# Altium project POE12V3A.PrjPcb
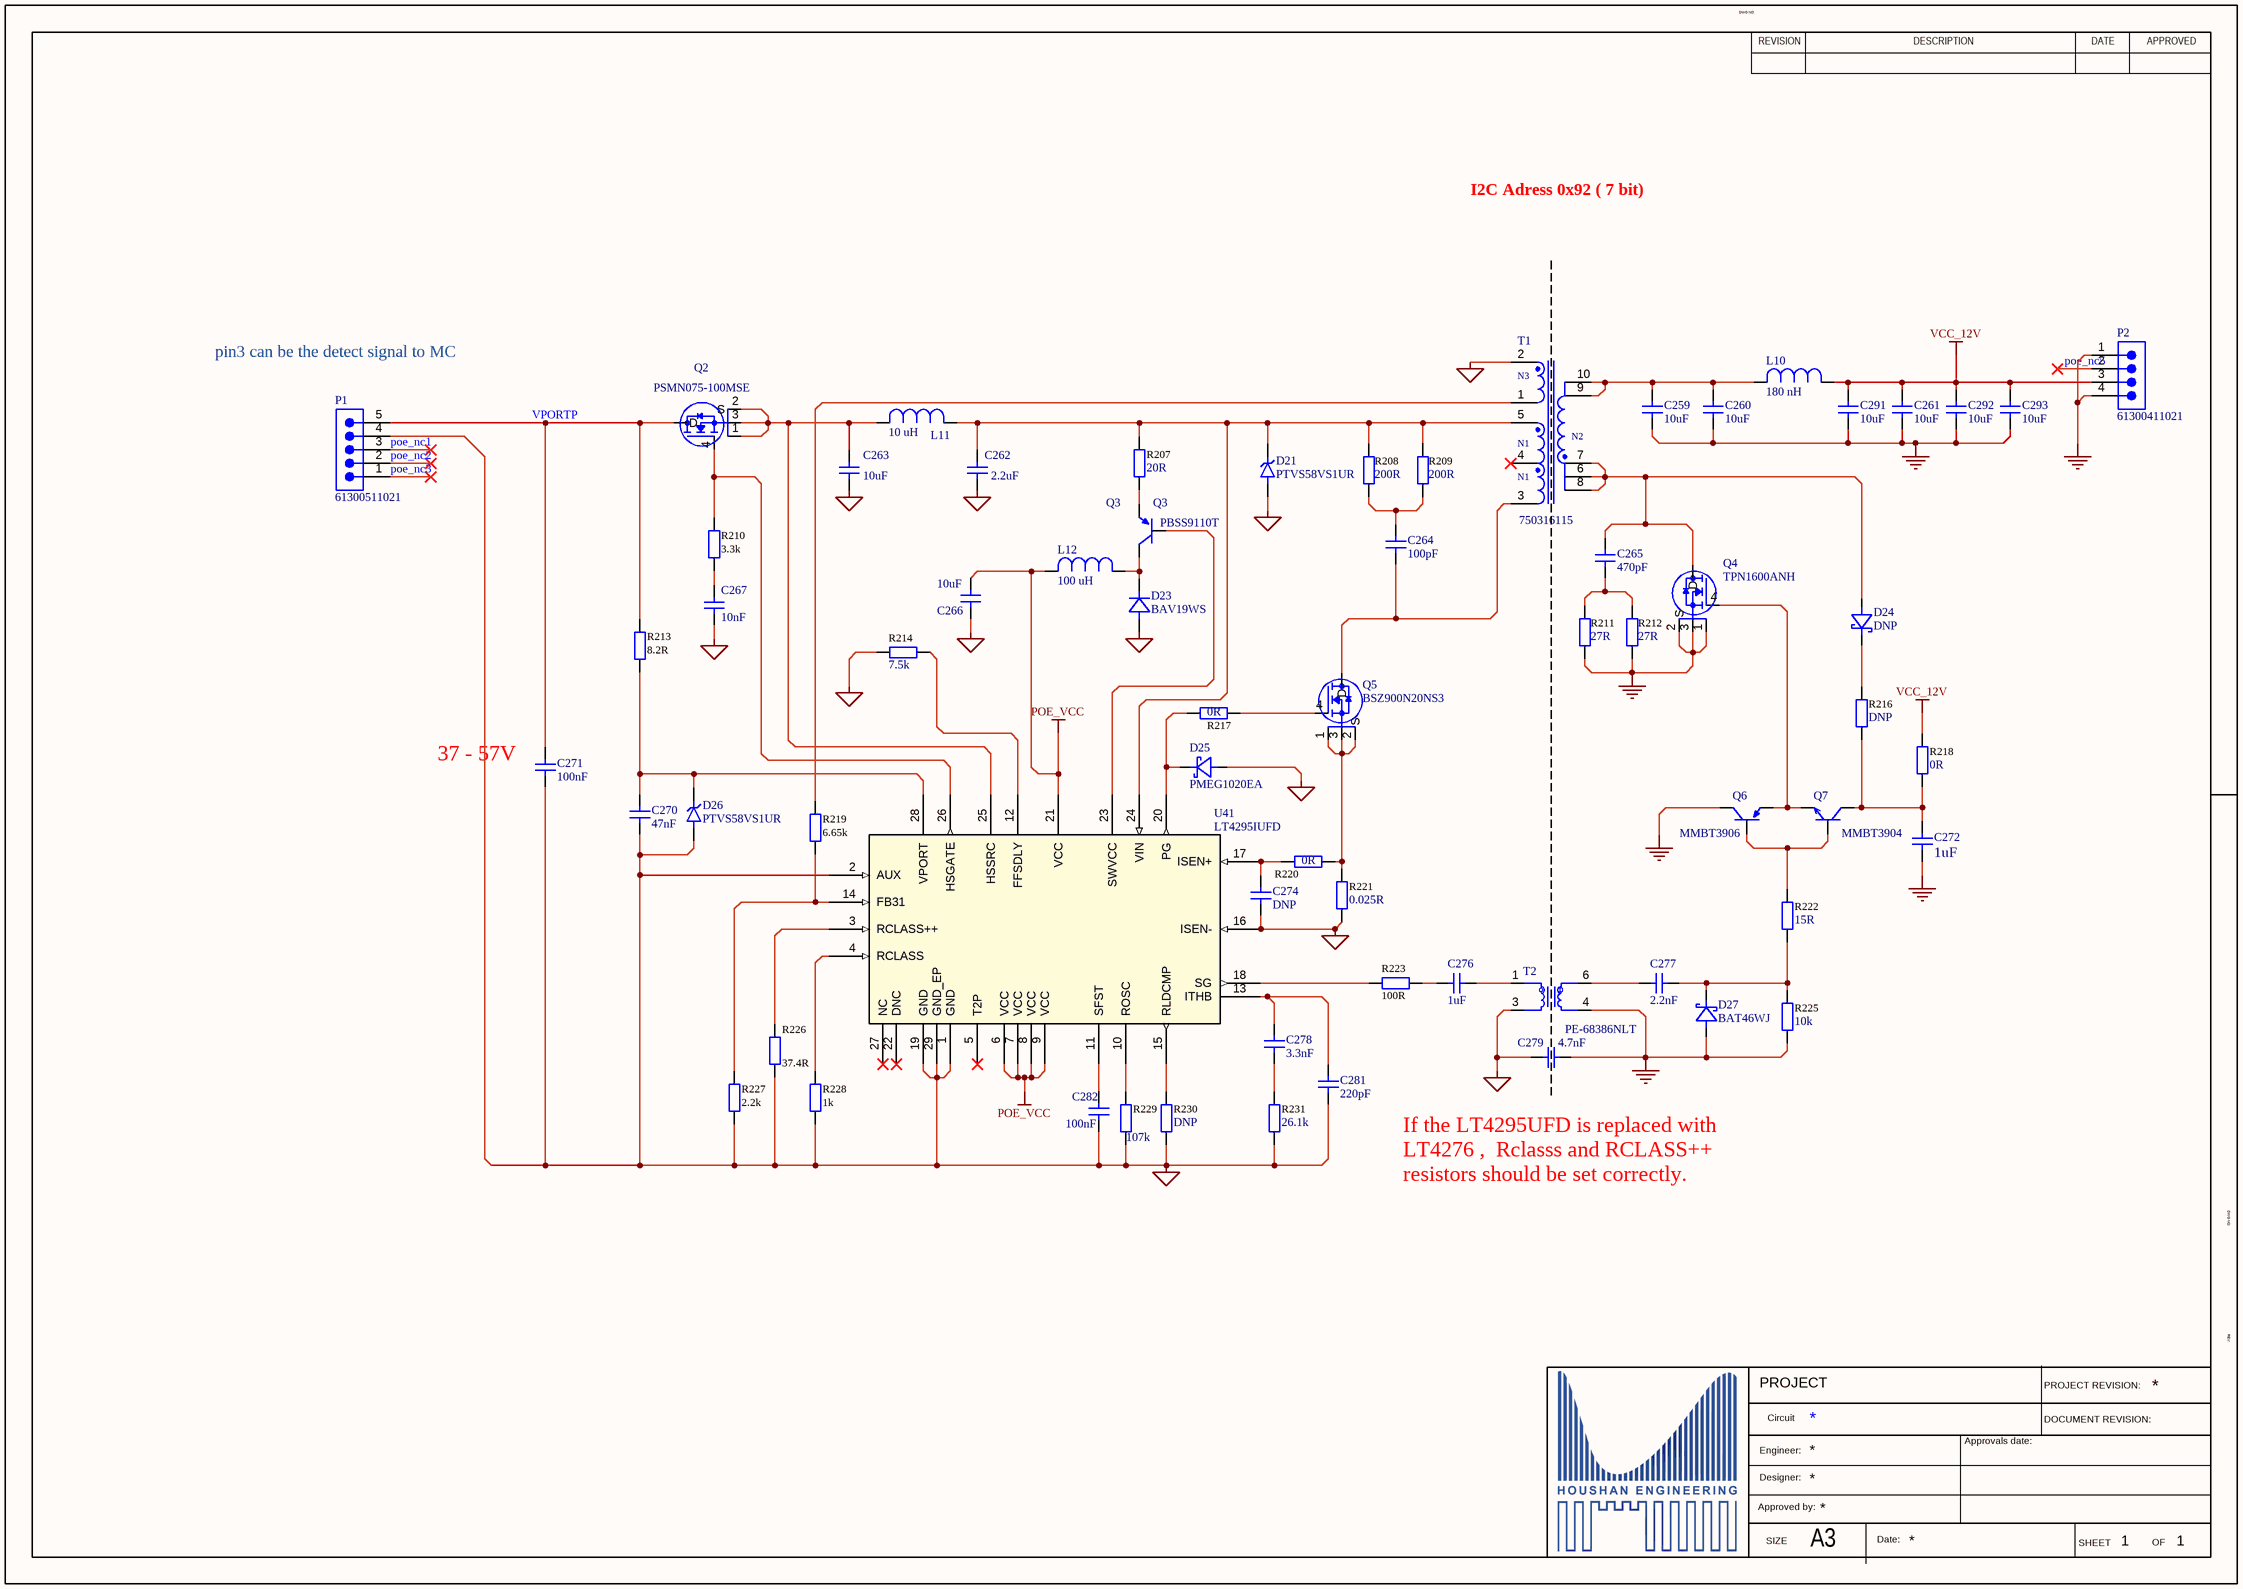
[diagram p0: POE.SchDoc]
1 sheet, 65 parts. Net scope: global (net labels, ports and power ports of the same name join across sheets).
Board file: POE.PcbDoc

## Sheet POE.SchDoc
size 420 x 297 mm; SheetNumber: 1; SheetTotal: 1

### Parts
C259  10uF  [C0805]
C260  10uF  [C0805]
C261  10uF  [C0805]
C262  2.2uF  [C1206]
C263  10uF  [C1210]
C264  100pF  [C1206]
C265  470pF  [C1206]
C266  10uF  [C1206]
C267  10nF  [C0603]
C270  47nF  [C0603]
C271  100nF  [C0603]
C272  1uF  [C0805]
C274  DNP  [C0402]
C276  1uF  [C0603]
C277  2.2nF  [C0603]
C278  3.3nF  [C0603]
C279  4.7nF  [C1812]
C281  220pF  [C0603]
C282  100nF  [C0603]
C291  10uF  [C0805]
C292  10uF  [C0805]
C293  10uF  [C0805]
D21  PTVS58VS1UR  [SOD123W]
D23  BAV19WS  [SOD323]
D24  DNP  [SOD323]
D25  PMEG1020EA  [SOD323]
D26  PTVS58VS1UR  [SOD123W]
D27  BAT46WJ  [SOD323F]
L10  180 nH  [IND_DO1813H_COC]
L11  10 uH  [IND_DO1607B_COC]
L12  100 uH  [IND_DO1607B_COC]
P1  61300511021  [61300511021]
P2  61300411021  [61300411021]
Q2  PSMN075-100MSE  [SOT1210]
Q3  PBSS9110T  [SOT23]
Q4  TPN1600ANH  [SOT1210]
Q5  BSZ900N20NS3  [SOT1210]
Q6  MMBT3906  [SOT23]
Q7  MMBT3904  [SOT23]
R207  20R  [R0805]
R208  200R  [R1206]
R209  200R  [R1206]
R210  3.3k  [R0603]
R211  27R  [R1206]
R212  27R  [R1206]
R213  8.2R  [R0805]
R214  7.5k  [R0603]
R216  DNP  [R0805]
R217  0R  [R0603]
R218  0R  [R0805]
R219  6.65k  [R0603]
R220  0R  [R0603]
R221  0.025R  [R1206]
R222  15R  [R0603]
R223  100R  [R0603]
R225  10k  [R0603]
R226  37.4R  [R0805]
R227  2.2k  [R0603]
R228  1k  [R0805]
R229  107k  [R0603]
R230  DNP  [R0603]
R231  26.1k  [R0603]
T1  750316115  [WE-PoE+_EP13_L17.75W13.46H12.7]
T2  PE-68386NLT  [SOP254P864X249-6N]
U41  LT4295IUFD  [QFN-29_UFD]

### Nets
GND: C259.1 C260.1 C261.1 C272.2 C279.1 C291.1 C292.1 C293.1 D27.2(A) P2.1 P2.4 Q4.1(S) Q4.2(S) Q4.3(S) Q6.3(C) R211.1 R212.1 R225.1 T2.4
POE_GND: C262.1 C263.1 C266.1 C267.1 C270.1 C271.1 C274.1 C279.2 C281.2 C282.1 D21.2(A) D23.2(A) D25.2(A) D26.2(A) P1.4 R214.2 R221.1 R226.1 R227.1 R228.1 R229.1 R230.1 R231.1 T1.2 T2.3 U41.1(GND) U41.2(AUX) U41.16(ISEN-) U41.19(GND) U41.29(GND_EP)
POE_VCC: C266.2 L12.2 U41.6(VCC) U41.7(VCC) U41.8(VCC) U41.9(VCC) U41.21(VCC)
VCC_12V: C261.2 C291.2 C292.2 C293.2 L10.1 P2.3 R218.2
poe_nc1: P1.3
poe_nc2: P1.2
poe_nc3: P1.1
poe_nc5: P2.2
VPORTP: C271.2 P1.5 Q2.MB(D) R213.2
NetC259_2: C259.2 C260.2 L10.2 T1.9 T1.10
NetC262_2: C262.2 D21.1(K) L11.1 R207.2 R208.2 R209.2 T1.5 U41.24(VIN)
NetC263_2: C263.2 L11.2 Q2.1(S) Q2.2(S) Q2.3(S) U41.25(HSSRC)
NetC264_1: C264.1 Q5.MB(D) T1.3
NetC264_2: C264.2 R208.1 R209.1
NetC265_1: C265.1 R211.2 R212.2
NetC265_2: C265.2 D24.2(A) Q4.MB(D) T1.6 T1.7 T1.8
NetC267_2: C267.2 R210.1
NetC270_2: C270.2 D26.1(K) R213.1 U41.28(VPORT)
NetC272_1: C272.1 Q7.3(C) R216.1 R218.1
NetC274_2: C274.2 R220.2 U41.17(ISEN+)
NetC276_1: C276.1 T2.1
NetC276_2: C276.2 R223.2
NetC277_1: C277.1 D27.1(K) R222.1 R225.2
NetC277_2: C277.2 T2.6
NetC278_1: C278.1 R231.2
NetC278_2: C278.2 C281.1 U41.13(ITHB)
NetC282_2: C282.2 U41.11(SFST)
NetD23_1: D23.1(K) L12.1 Q3.3(C)
NetD24_1: D24.1(K) R216.2
NetD25_1: D25.1(K) R217.2 U41.20(PG)
NetQ2_4: Q2.4(G) R210.2 U41.26(HSGATE)
NetQ3_1: Q3.1(B) U41.23(SWVCC)
NetQ3_2: Q3.2(E) R207.1
NetQ4_4: Q4.4(G) Q6.2(E) Q7.2(E)
NetQ5_1: Q5.1(S) Q5.2(S) Q5.3(S) R220.1 R221.2
NetQ5_4: Q5.4(G) R217.1
NetQ6_1: Q6.1(B) Q7.1(B) R222.2
NetR214_1: R214.1 U41.12(FFSDLY)
NetR219_1: R219.1 R227.2 U41.14(FB31)
NetR219_2: R219.2 T1.1
NetR223_1: R223.1 U41.18(SG)
NetR226_2: R226.2 U41.3(RCLASS++)
NetR228_2: R228.2 U41.4(RCLASS)
NetR229_2: R229.2 U41.10(ROSC)
NetR230_2: R230.2 U41.15(RLDCMP)

Not connected (* = marked no-connect by the designer): T1 4*; U41 5(T2P)* 22(DNC)* 27(NC)*

### Notes on the sheet
- I2C Adress 0x92 ( 7 bit)
- pin3 can be the detect signal to MC
- Q3
- (near C271) 37 - 57V
- If the LT4295UFD is replaced with LT4276 ,  Rclasss and RCLASS++ resistors should be set correctly.
- DWG NO:
- REVISION
- DESCRIPTION
- DATE
- APPROVED
- REV:
- PROJECT
- PROJECT REVISION:
- Engineer:
- Circuit
- Approvals date:
- DOCUMENT REVISION:
- Approved by:
- Designer:
- SIZE
- Date:
- SHEET
- OF
- A3
- (in symbol 750316115) N3; N2; N1

### Library data of the parts
C259-C261 C291-C293 = C0805_10uF_50V_10%_X5R: Multilayer Ceramic Capacitors MLCC - SMD/SMT 10uF 50V X5R C0805 10 %; Tolerance: 10%; Assembly: SMT; Part Number: C0805_10uF_50V_10%_X5R; Pin Count: 2; Value: 10uF; Manufacturer Part Number: C0805_10uF_50V_10%_X5R; Category: MLCC; Component Height: 0.45mm; Temperature Coefficient: X5R; Voltage Rating: 50V
C262 = C1206_2.2uF_100V_10%_X7R: Multilayer Ceramic Capacitors MLCC - SMD/SMT 2.2uF 100V X7R 1206 10%; Assembly: SMT; Part Number: C1206_2.2uF_100V_10%_X7R; Category: MLCC; Pin Count: 2; Component Height: 1.6mm; Value: 2.2uF; Manufacturer Part Number: C1206_2.2uF_100V_10%_X7R; Temperature Coefficient: X7R; Tolerance: 10%; Voltage Rating: 100V
C263 = C1210_10uF_100V_10%_X7S: Multilayer Ceramic Capacitors MLCC - SMD/SMT 10uF 100V X7S 1210 10%; Assembly: SMT; Part Number: C1210_10uF_100V_10%_X7S; Category: MLCC; Pin Count: 2; Component Height: 2mm; Value: 10uF; Manufacturer Part Number: C1210_10uF_100V_10%_X7S; Temperature Coefficient: X7S; Tolerance: 10%; Voltage Rating: 100V
C264 = C1206_100pF_630V_5%_U2J: Multilayer Ceramic Capacitors MLCC - SMD/SMT 100pF 630V U2J 1206 5%; Assembly: SMT; Part Number: C1206_100pF_630V_5%_U2J; Pin Count: 2; Value: 100pF; Tolerance: 5%; Manufacturer Part Number: C1206_100pF_630V_5%_U2J; Category: MLCC; Component Height: 0.55mm; Temperature Coefficient: U2J; Voltage Rating: 630V
C265 = C1206_470pF_630V_5%_U2J: Multilayer Ceramic Capacitors MLCC - SMD/SMT 470pF 630V U2J 1206 5%; Assembly: SMT; Part Number: C1206_470pF_630V_5%_U2J; Pin Count: 2; Value: 470pF; Tolerance: 5%; Manufacturer Part Number: C1206_470pF_630V_5%_U2J; Category: MLCC; Component Height: 0.55mm; Temperature Coefficient: U2J; Voltage Rating: 630V
C266 = C1206_10uF_25V_10%_X7R: Multilayer Ceramic Capacitors MLCC - SMD/SMT 10uF 25V X7R 1206  10%; Assembly: SMT; Part Number: C1206_10uF_25V_10%_X7R; Category: MLCC; Pin Count: 2; Component Height: 0.55mm; Value: 10uF; Manufacturer Part Number: C1206_10uF_25V_10%_X7R; Temperature Coefficient: X7R; Tolerance: 10%; Voltage Rating: 25V
C267 = C0603_10nF_100V_10%_X7R: Multilayer Ceramic Capacitors MLCC - SMD/SMT 0.01uF 100V X7R 0603 10%; Assembly: SMT; Part Number: C0603_10nF_100V_10%_X7R; Pin Count: 2; Value: 10nF; Tolerance: 10%; Manufacturer Part Number: C0603_10nF_100V_10%_X7R; Category: MLCC; Component Height: 0.45mm; Temperature Coefficient: X7R; Voltage Rating: 100V
C270 = C0603_47nF_100V_20%_X7R: Multilayer Ceramic Capacitors MLCC - SMD/SMT 0.047uF 100V X7R 0603 20%; Assembly: SMT; Part Number: C0603_47nF_100V_20%_X7R; Pin Count: 2; Value: 47nF; Tolerance: 20%; Manufacturer Part Number: C0603_47nF_100V_20%_X7R; Category: MLCC; Component Height: 0.45mm; Temperature Coefficient: X7R; Voltage Rating: 100V
C271 C282 = C0603_100nF_100V_10%_X7R: Multilayer Ceramic Capacitors MLCC - SMD/SMT 0.1uF 25V X7R 0603 10%; Assembly: SMT; Voltage Rating: 100V; Part Number: C0603_100nF_100V_10%_X7R; Pin Count: 2; Value: 100nF; Tolerance: 10%; Manufacturer Part Number: C0603_100nF_100V_10%_X7R; Category: MLCC; Component Height: 0.45mm; Temperature Coefficient: X7R
C272 = C0805_1uF_25V_10%_X7R: Multilayer Ceramic Capacitors MLCC - SMD/SMT 1uF 25V X7R 0805 10%; Assembly: SMT; Part Number: C0805_1uF_25V_10%_X7R; Category: MLCC; Pin Count: 2; Component Height: 0.45mm; Value: 1uF; Manufacturer Part Number: C0805_1uF_25V_10%_X7R; Temperature Coefficient: X7R; Tolerance: 10%; Voltage Rating: 25V
C274 = C0402_10nF_100V_20%_X5R: Multilayer Ceramic Capacitors MLCC - SMD/SMT 10nF 100V X5R C0402 20 %; Assembly: SMT; Tolerance: 20%; Part Number: C0402_10nF_100V_20%_X5R; Category: MLCC; Pin Count: 2; Component Height: 0.35mm; Value: 10nF; Manufacturer Part Number: C0402_10nF_100V_20%_X5R; Temperature Coefficient: X5R; Voltage Rating: 100V
C276 = C0603_1uF_25V_10%_X7R: Multilayer Ceramic Capacitors MLCC - SMD/SMT 1uF 25V X7R 0603 10%; Assembly: SMT; Part Number: C0603_1uF_25V_10%_X7R; Pin Count: 2; Value: 1uF; Tolerance: 10%; Manufacturer Part Number: C0603_1uF_25V_10%_X7R; Category: MLCC; Component Height: 0.45mm; Temperature Coefficient: X7R; Voltage Rating: 25V
C277 = C0603_2.2nF_25V_10%_X7R: Multilayer Ceramic Capacitors MLCC - SMD/SMT 2200pF 25V X7R 0603 10%; Assembly: SMT; Part Number: C0603_2.2nF_25V_10%_X7R; Pin Count: 2; Value: 2.2nF; Tolerance: 10%; Manufacturer Part Number: C0603_2.2nF_25V_10%_X7R; Category: MLCC; Component Height: 0.45mm; Temperature Coefficient: X7R; Voltage Rating: 25V
C278 = C0603_3.3nF_25V_10%_X7R: Multilayer Ceramic Capacitors MLCC - SMD/SMT 3300pF 25V X7R 0603 10%; Assembly: SMT; Part Number: C0603_3.3nF_25V_10%_X7R; Pin Count: 2; Value: 3.3nF; Tolerance: 10%; Manufacturer Part Number: C0603_3.3nF_25V_10%_X7R; Category: MLCC; Component Height: 0.45mm; Temperature Coefficient: X7R; Voltage Rating: 25V
C279 = C1812_4.7nF_2kV_10%_X7R: Multilayer Ceramic Capacitors MLCC - SMD/SMT 4700pF 2kV X7R 1812 10%; Assembly: SMT; Part Number: C1812_4.7nF_2kV_10%_X7R; Pin Count: 2; Value: 4.7nF; Tolerance: 10%; Manufacturer Part Number: C1812_4.7nF_2kV_10%_X7R; Category: MLCC; Component Height: 0.55mm; Temperature Coefficient: X7R; Voltage Rating: 2kV
C281 = C0603_220pF_25V_10%_X7R: Multilayer Ceramic Capacitors MLCC - SMD/SMT 220pF 25V X7R 0603 10%; Assembly: SMT; Part Number: C0603_220pF_25V_10%_X7R; Pin Count: 2; Value: 220pF; Tolerance: 10%; Manufacturer Part Number: C0603_220pF_25V_10%_X7R; Category: MLCC; Component Height: 0.45mm; Temperature Coefficient: X7R; Voltage Rating: 25V
D21 D26 = PTVS58VS1UR: ESD Protection Diodes / TVS Diodes PTVS58VS1UR/SOD123W/SOD2; Manufacturer: NEXPERIA; Manufacturer Part Number: PTVS58VS1UR,115; MP: MMSZ5252BS-7-F; Assembly: SMT; Reverse Voltage Vrrm: 58V; Package: SOD123; Value: PTVS58VS1UR; Price: None; Availability: Unavailable; Part Number: PTVS58VS1UR; Pin Count: 2; Category: TVS; Datasheet: https://assets.nexperia.com/documents/data-sheet/PTVSXS1UR_SER.pdf
D23 = BAV19WS: Small Signal Switching Diodes 120V 250mW; Manufacturer: Diodes Inc.; Manufacturer Part Number: BAV19WS-7-F; Assembly: SMT; Forward Current If: 200 mA; Part Number: BAV19WS; Pin Count: 2; Package: SOD323; Category: Diode; Value: BAV19WS; Datasheet: https://www.diodes.com/part/view/BAV19WS#; Reverse Voltage Vrrm: 120V
D24 = Schottky_DNP: Schottky 40V; Assembly: SMT; Part Number: Schottky_DNP; Pin Count: 2; Package: SOD323; Category: Schottky; Value: DNP; Reverse Voltage Vrrm: 40V
D25 = PMEG1020EA: Schottky Diodes & Rectifiers PMEG1020EA/SOD323/SOD2; Manufacturer: Nexperia; Assembly: SMT; Reverse Voltage Vrrm: 10V; Forward Current If: 2A; Part Number: PMEG1020EA; Pin Count: 2; Package: SOD323; Manufacturer Part Number: PMEG1020EA; Category: Schottky; Value: PMEG1020EA; Datasheet: https://assets.nexperia.com/documents/data-sheet/PMEG1020EA.pdf
D27 = BAT46WJ: 100 V, Schottky Diodes & Rectifiers BAT46WJ/SOD323F/SOD323F; Manufacturer: Nexperia; Manufacturer Part Number: BAT46WJ,115; Assembly: SMT; Reverse Voltage Vrrm: 100V; Forward Current If: 250 mA; Part Number: BAT46WJ; Pin Count: 2; Package: SOD323F; Category: Schottky; Value: BAT46WJ; Datasheet: https://assets.nexperia.com/documents/data-sheet/BAT46WJ.pdf
L10 = DO1813H-181: Power Inductors - SMD 180nH Unshld 20% 10A 3mOhms; Manufacturer: Coilcraft; Manufacturer Part Number: DO1813H-181MLD; Max DC Resistance: 0.0030 Ohms; Saturation Current: 14 A; Self Resonant Frequency: 800 MHz; Assembly: SMT; Part Number: DO1813H-181; Pin Count: 2; Inductance: 180 nH; Max DC Current: 10 A; Category: Inductor; Component Height: 5mm; Value: 180 nH; Datasheet: https://www.coilcraft.com/getmedia/eceb5548-303f-4cbf-872a-303f3b222949/do1813h.pdf
L11 = DO1608C-103: Power Inductors - SMD 10uH Shld 20% 1.5A 160mOhms; Manufacturer: Coilcraft; Manufacturer Part Number: DO1608C-103MLC; Saturation Current: 1.1 A; Self Resonant Frequency: 35 MHz; Assembly: SMT; Part Number: DO1608C-103; Pin Count: 2; Inductance: 10 uH; Max DC Current: 1.5A; Max DC Resistance: 160 mOhms; Category: Inductor; Value: 10 uH; Datasheet: https://www.coilcraft.com/getmedia/4cc14c66-6f6e-44d5-bdfa-285965aec659/do1608c.pdf
L12 = DO1608C-104: Power Inductors - SMD 10uH Shld 20% 1.5A 160mOhms; Manufacturer: Coilcraft; Manufacturer Part Number: DO1608C-103MLC; Max DC Current: 500 mA; Max DC Resistance: 1.27 Ohms; Saturation Current: 310 mA; Self Resonant Frequency: 9 MHz; Assembly: SMT; Part Number: DO1608C-104; Pin Count: 2; Inductance: 100 uH; Category: Inductor; Component Height: 2.92mm; Value: 100 uH; Datasheet: https://www.coilcraft.com/getmedia/4cc14c66-6f6e-44d5-bdfa-285965aec659/do1608c.pdf
P1 = 61300511021: Pin Header, pitch 2.54 mm,PTH, Right Angle, single row, 5p, gold contact plating, 3A current rating; Manufacturer: Wurth Electronics; Assembly: SMT; Voltage Rating: 250V; Part Number: 61300511021; Category: Pin Header-RA; Pin Count: 5; Component Height: 9.6mm; Value: 61300511021; Manufacturer Part Number: 61300511021; Datasheet: https://www.we-online.com/components/products/datasheet/61001221121.pdf
P2 = 61300411021: Pin Header, pitch 2.54 mm,PTH, Right Angle, single row, 4p, gold contact plating, 3A current rating; Manufacturer: Wurth Electronics; Assembly: SMT; Voltage Rating: 500V; Part Number: 61300411021; Category: Pin Header-RA; Pin Count: 4; Component Height: 9.6mm; Value: 61300411021; Manufacturer Part Number: 61300411021; Datasheet: https://www.we-online.com/components/products/datasheet/61001221121.pdf
Q2 = PSMN075-100MSEX: N-Channel 100V 18A (Tj) 65W (Tc) Surface Mount LFPAK33; Manufacturer: NEXPERIA; Assembly: SMT; Part Number: PSMN075-100MSEX; Pin Count: 8; Power Rating: 65W; Voltage Rated: 100V; Manufacturer Part Number: PSMN075-100MSEX; Category: Mosfet; Value: PSMN075-100MSE; Datasheet: https://assets.nexperia.com/documents/data-sheet/PSMN075-100MSE.pdf; Drain Current: 18A
Q3 = PBSS9110T: Trans GP BJT PNP 100V 300mW 1 A 3-Pin SOT-23; Manufacturer: NEXPERIA; Assembly: SMT; Part Number: PBSS9110T; Pin Count: 3; Power Rating: 300 mW; Voltage Rated: 100V; Manufacturer Part Number: PBSS9110T; Category: BJT; Value: PBSS9110T; Datasheet: https://assets.nexperia.com/documents/data-sheet/PBSS9110T.pdf
Q4 = TPN1600ANH: Silicon N-channel MOS, 100V, 18A; Manufacturer: Toshiba; Power Rating: 42W; Assembly: SMT; Part Number: TPN1600ANH; Pin Count: 8; Voltage Rated: 100V; Manufacturer Part Number: TPN1600ANH; Category: Mosfet; Component Height: 0.85mm; Value: TPN1600ANH; Datasheet: https://toshiba.semicon-storage.com/info/TPN1600ANH_datasheet_en_20191018.pdf?did=13538&prodName=TPN1600ANH; Drain Current: 18A
Q5 = BSZ900N20NS3: MOSFETs N-Ch 200V 15.2A TDSON-8 OptiMOS 3; Manufacturer: Infineon; Manufacturer Part Number: BSZ900N20NS3GATMA1; Power Rating: 15.2W; Assembly: SMT; Part Number: BSZ900N20NS3; Pin Count: 8; Voltage Rated: 200V; Category: Mosfet; Value: BSZ900N20NS3; Datasheet: https://www.infineon.com/dgdl/Infineon-BSZ900N20NS3-DS-v02_02-en.pdf?fileId=db3a30432ad629a6012b15f1be561a9b; Drain Current: 15.2A
Q6 = MMBT3906: Trans GP BJT PNP 40V 3-Pin SOT-23; Manufacturer: NEXPERIA; Power Rating: 200mW; Assembly: SMT; Part Number: MMBT3906; Pin Count: 3; Voltage Rated: 40V; Manufacturer Part Number: MMBT3906; Category: BJT; Value: MMBT3906; Datasheet: https://assets.nexperia.com/documents/data-sheet/MMBT3906.pdf
Q7 = MMBT3904: Trans GP BJT NPN 40V 3-Pin SOT-23; Manufacturer: NEXPERIA; Power Rating: 200mW; Assembly: SMT; Part Number: MMBT3904; Pin Count: 3; Voltage Rated: 40V; Manufacturer Part Number: MMBT3904; Category: BJT; Value: MMBT3904; Datasheet: https://assets.nexperia.com/documents/data-sheet/MMBT3904.pdf
R207 = R0805_20R_1%_62.5mW_100PPM_150V: resistor; Tolerance: 1%; Power Rating: 62.5mW; Temperature Coefficient: ±100ppm/°C; Assembly: SMT; Voltage Rating: 150V; Part Number: R0805_20R_1%_62.5mW_100PPM_150V; Pin Count: 2; Value: 20R; Manufacturer Part Number: R0805_20R_1%_62.5mW_100PPM_150V; Category: Film Resistor
R208 R209 = R1206_200R_1%_250mW_100PPM_200V: resistor; Assembly: SMT; Tolerance: 1%; Power Rating: 250mW; Voltage Rating: 200V; Temperature Coefficient: ±100ppm/°C; Part Number: R1206_200R_1%_250mW_100PPM_200V; Category: Film Resistor; Pin Count: 2; Value: 200R; Manufacturer Part Number: R1206_200R_1%_250mW_100PPM_200V
R210 = R0603_3.3k_1%_62.5mW_100PPM_75V: resistor; Tolerance: 1%; Power Rating: 62.5mW; Temperature Coefficient: ±100ppm/°C; Assembly: SMT; Voltage Rating: 75V; Part Number: R0603_3.3k_1%_62.5mW_100PPM_75V; Pin Count: 2; Value: 3.3k; Manufacturer Part Number: R0603_3.3k_1%_62.5mW_100PPM_75V; Category: Film Resistor
R211 R212 = R1206_27R_1%_250mW_100PPM_200V: resistor; Assembly: SMT; Tolerance: 1%; Power Rating: 250mW; Voltage Rating: 200V; Temperature Coefficient: ±100ppm/°C; Part Number: R1206_27R_1%_250mW_100PPM_200V; Category: Film Resistor; Pin Count: 2; Value: 27R; Manufacturer Part Number: R1206_27R_1%_250mW_100PPM_200V
R213 = R0805_8.2R_1%_62.5mW_100PPM_150V: resistor; Tolerance: 1%; Power Rating: 62.5mW; Temperature Coefficient: ±100ppm/°C; Assembly: SMT; Voltage Rating: 150V; Part Number: R0805_8.2R_1%_62.5mW_100PPM_150V; Pin Count: 2; Value: 8.2R; Manufacturer Part Number: R0805_8.2R_1%_62.5mW_100PPM_150V; Category: Film Resistor
R214 = R0603_7.5k_1%_62.5mW_100PPM_75V: resistor; Tolerance: 1%; Power Rating: 62.5mW; Temperature Coefficient: ±100ppm/°C; Assembly: SMT; Voltage Rating: 75V; Part Number: R0603_7.5k_1%_62.5mW_100PPM_75V; Pin Count: 2; Value: 7.5k; Manufacturer Part Number: R0603_7.5k_1%_62.5mW_100PPM_75V; Category: Film Resistor
R216 = R0805_1k_1%_62.5mW_100PPM_150V: resistor; Value: 1k; Power Rating: 62.5mW; Temperature Coefficient: ±100ppm/°C; Assembly: SMT; Tolerance: 1%; Voltage Rating: 150V; Part Number: R0805_1k_1%_62.5mW_100PPM_150V; Pin Count: 2; Category: Film Resistor; Manufacturer Part Number: R0805_1k_1%_62.5mW_100PPM_150V
R217 R220 = R0603_0R_1%_62.5mW_100PPM_75V: resistor; Tolerance: 1%; Power Rating: 62.5mW; Temperature Coefficient: ±100ppm/°C; Assembly: SMT; Voltage Rating: 75V; Part Number: R0603_0R_1%_62.5mW_100PPM_75V; Pin Count: 2; Value: 0R; Manufacturer Part Number: R0603_0R_1%_62.5mW_100PPM_75V; Category: Film Resistor
R218 = R0805_0R_1%_62.5mW_100PPM_150V: resistor; Tolerance: 1%; Power Rating: 62.5mW; Temperature Coefficient: ±100ppm/°C; Assembly: SMT; Voltage Rating: 150V; Part Number: R0805_0R_1%_62.5mW_100PPM_150V; Pin Count: 2; Value: 0R; Manufacturer Part Number: R0805_0R_1%_62.5mW_100PPM_150V; Category: Film Resistor
R219 = R0603_6.65k_1%_62.5mW_100PPM_75V: resistor; Tolerance: 1%; Power Rating: 62.5mW; Temperature Coefficient: ±100ppm/°C; Assembly: SMT; Voltage Rating: 75V; Part Number: R0603_6.65k_1%_62.5mW_100PPM_75V; Pin Count: 2; Value: 6.65k; Manufacturer Part Number: R0603_6.65k_1%_62.5mW_100PPM_75V; Category: Film Resistor
R221 = R1206_0.025R_1%_250mW_100PPM_200V: resistor; Tolerance: 1%; Power Rating: 250mW; Temperature Coefficient: ±100ppm/°C; Assembly: SMT; Voltage Rating: 200V; Part Number: R1206_0.025R_1%_250mW_100PPM_200V; Pin Count: 2; Value: 0.025R; Manufacturer Part Number: R1206_0.025R_1%_250mW_100PPM_200V; Category: Film Resistor
R222 = R0603_15R_1%_62.5mW_100PPM_75V: resistor; Tolerance: 1%; Power Rating: 62.5mW; Temperature Coefficient: ±100ppm/°C; Assembly: SMT; Voltage Rating: 75V; Part Number: R0603_15R_1%_62.5mW_100PPM_75V; Pin Count: 2; Value: 15R; Manufacturer Part Number: R0603_15R_1%_62.5mW_100PPM_75V; Category: Film Resistor
R223 = R0603_100R_1%_62.5mW_100PPM_75V: resistor; Tolerance: 1%; Power Rating: 62.5mW; Temperature Coefficient: ±100ppm/°C; Assembly: SMT; Voltage Rating: 75V; Part Number: R0603_100R_1%_62.5mW_100PPM_75V; Pin Count: 2; Value: 100R; Manufacturer Part Number: R0603_100R_1%_62.5mW_100PPM_75V; Category: Film Resistor
R225 = R0603_10k_1%_62.5mW_100PPM_75V: resistor; Tolerance: 1%; Power Rating: 62.5mW; Temperature Coefficient: ±100ppm/°C; Assembly: SMT; Voltage Rating: 75V; Part Number: R0603_10k_1%_62.5mW_100PPM_75V; Pin Count: 2; Value: 10k; Manufacturer Part Number: R0603_10k_1%_62.5mW_100PPM_75V; Category: Film Resistor
R226 = R0805_37.4R_1%_62.5mW_100PPM_150V: resistor; Tolerance: 1%; Power Rating: 62.5mW; Temperature Coefficient: ±100ppm/°C; Assembly: SMT; Voltage Rating: 150V; Part Number: R0805_37.4R_1%_62.5mW_100PPM_150V; Pin Count: 2; Value: 37.4R; Manufacturer Part Number: R0805_37.4R_1%_62.5mW_100PPM_150V; Category: Film Resistor
R227 = R0603_2.2k_1%_62.5mW_100PPM_75V: resistor; Tolerance: 1%; Power Rating: 62.5mW; Temperature Coefficient: ±100ppm/°C; Assembly: SMT; Voltage Rating: 75V; Part Number: R0603_2.2k_1%_62.5mW_100PPM_75V; Pin Count: 2; Value: 2.2k; Manufacturer Part Number: R0603_2.2k_1%_62.5mW_100PPM_75V; Category: Film Resistor
R228 = R0805_1k_1%_62.5mW_100PPM_150V: resistor; Tolerance: 1%; Power Rating: 62.5mW; Temperature Coefficient: ±100ppm/°C; Assembly: SMT; Voltage Rating: 150V; Part Number: R0805_1k_1%_62.5mW_100PPM_150V; Pin Count: 2; Value: 1k; Manufacturer Part Number: R0805_1k_1%_62.5mW_100PPM_150V; Category: Film Resistor
R229 = R0603_107k_1%_62.5mW_100PPM_75V: resistor; Tolerance: 1%; Power Rating: 62.5mW; Temperature Coefficient: ±100ppm/°C; Assembly: SMT; Voltage Rating: 75V; Part Number: R0603_107k_1%_62.5mW_100PPM_75V; Pin Count: 2; Value: 107k; Manufacturer Part Number: R0603_107k_1%_62.5mW_100PPM_75V; Category: Film Resistor
R230 = R0603_51k_1%_62.5mW_100PPM_75V: resistor; Value: 51k; Power Rating: 62.5mW; Assembly: SMT; Tolerance: 1%; Voltage Rating: 75V; Temperature Coefficient: ±100ppm/°C; Part Number: R0603_51k_1%_62.5mW_100PPM_75V; Pin Count: 2; Category: Film Resistor; Manufacturer Part Number: R0603_51k_1%_62.5mW_100PPM_75V
R231 = R0603_26.1k_1%_62.5mW_100PPM_75V: resistor; Tolerance: 1%; Power Rating: 62.5mW; Temperature Coefficient: ±100ppm/°C; Assembly: SMT; Voltage Rating: 75V; Part Number: R0603_26.1k_1%_62.5mW_100PPM_75V; Pin Count: 2; Value: 26.1k; Manufacturer Part Number: R0603_26.1k_1%_62.5mW_100PPM_75V; Category: Film Resistor
T1 = 750316115: Flyback trnsformer 12V 3A, 2:1; Manufacturer: Wurth Elektronik; Turn Ratio: 2:1:1; Voltage Rated: 42-57Vdc; Assembly: SMT; Part Number: 750316115; Pin Count: 10; Manufacturer Part Number: 750316115; Category: Flyback; Datasheet: https://www.we-online.com/components/products/datasheet/750316115.pdf
T2 = PE-68386NLT: 785ÂµH Pulse Transformer 1:1 Surface Mount; Manufacturer: Pulse Electronics; Voltage Rated: 1500Vdc; Assembly: SMT; Part Number: PE-68386NLT; Pin Count: 4; Turn Ratio: 1:1; Manufacturer Part Number: PE-68386NLT; Category: XFAR; Datasheet: https://productfinder.pulseelectronics.com/api/open/part-attachments/datasheet/pe-68386nlt
U41 = LT4295IUFD: Power Switch ICs - POE/LAN IEEE 802.3bt PD Int w/ For/Fly Cntr; Manufacturer: Analog Device; Manufacturer Part Number: LT4295IUFD#TRPBF; Voltage Rated: 57 V; Assembly: SMT; Part Number: LT4295IUFD; Pin Count: 28; Package: QFN; Category: POE Controller; Component Height: 0.75mm; Value: LT4295IUFD; Datasheet: https://www.analog.com/media/en/technical-documentation/data-sheets/LT4295.pdf